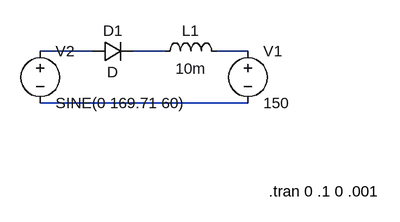
[diagram p0: schematic HW1q3.asc]
HW1q3.asc, the LTspice schematic file:
Version 4.1
SHEET 1 880 680
WIRE -208 48 -288 48
WIRE -96 48 -144 48
WIRE 32 48 -16 48
WIRE 32 128 -288 128
SYMBOL voltage 32 32 R0
WINDOW 123 0 0 Left 0
WINDOW 39 0 0 Left 0
SYMATTR InstName V1
SYMATTR Value 150
SYMBOL ind -112 64 R270
WINDOW 0 32 56 VTop 2
WINDOW 3 5 56 VBottom 2
SYMATTR InstName L1
SYMATTR Value 10m
SYMBOL diode -208 64 R270
WINDOW 0 32 32 VTop 2
WINDOW 3 0 32 VBottom 2
SYMATTR InstName D1
SYMBOL voltage -288 32 R0
WINDOW 123 0 0 Left 0
WINDOW 39 0 0 Left 0
SYMATTR InstName V2
SYMATTR Value SINE(0 169.71 60)
TEXT 64 264 Left 2 !.tran 0 .1 0 .001

The netlist it stands for:
* HW1q3.asc
V1 N003 N004 150
L1 N002 N003 10m
D1 N001 N002 D
V2 N001 N004 SINE(0 169.71 60)
.model D D
.lib standard.dio
.tran 0 .1 0 .001
.backanno
.end